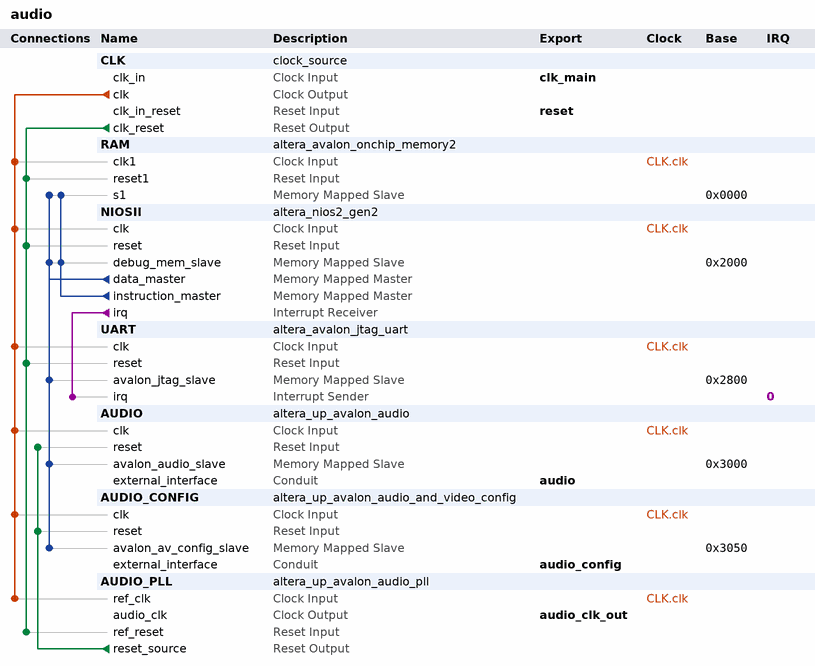
[diagram p0: system contents]
# Platform Designer (Qsys) system audio, Cyclone V 5CSEMA5F31C6
# Parameters at their usual value, and those the tool derives, are not listed.
package require -exact qsys 18.1
create_system audio
set_project_property DEVICE_FAMILY {Cyclone V}
set_project_property DEVICE 5CSEMA5F31C6

add_instance CLK clock_source 18.1
set_instance_parameter_value CLK clockFrequency 50000000
set_instance_parameter_value CLK clockFrequencyKnown false

add_instance RAM altera_avalon_onchip_memory2 18.1
set_instance_parameter_value RAM dataWidth 32
set_instance_parameter_value RAM dualPort false
set_instance_parameter_value RAM initMemContent true
set_instance_parameter_value RAM initializationFileName onchip_mem.hex
set_instance_parameter_value RAM memorySize 8192

add_instance NIOSII altera_nios2_gen2 18.1
set_instance_parameter_value NIOSII dcache_size 2048
set_instance_parameter_value NIOSII exceptionSlave RAM.s1
set_instance_parameter_value NIOSII icache_size 4096
set_instance_parameter_value NIOSII impl Tiny
set_instance_parameter_value NIOSII resetSlave RAM.s1

add_instance UART altera_avalon_jtag_uart 18.1
set_instance_parameter_value UART simInteractiveOptions NO_INTERACTIVE_WINDOWS

add_instance AUDIO altera_up_avalon_audio 18.0
set_instance_parameter_value AUDIO audio_in false
set_instance_parameter_value AUDIO avalon_bus_type {Memory Mapped}
set_instance_parameter_value AUDIO dw 16

add_instance AUDIO_CONFIG altera_up_avalon_audio_and_video_config 18.0
set_instance_parameter_value AUDIO_CONFIG audio_in {Microphone to ADC}
set_instance_parameter_value AUDIO_CONFIG bit_length 16
set_instance_parameter_value AUDIO_CONFIG board DE1-SoC
set_instance_parameter_value AUDIO_CONFIG line_in_bypass false
set_instance_parameter_value AUDIO_CONFIG sampling_rate {48 kHz}

add_instance AUDIO_PLL altera_up_avalon_audio_pll 18.0
set_instance_parameter_value AUDIO_PLL gui_refclk 50.0

# connections
add_connection CLK.clk AUDIO.clk clock
add_connection CLK.clk AUDIO_CONFIG.clk clock
add_connection CLK.clk AUDIO_PLL.ref_clk clock
add_connection CLK.clk NIOSII.clk clock
add_connection CLK.clk RAM.clk1 clock
add_connection CLK.clk UART.clk clock
add_connection AUDIO_PLL.reset_source AUDIO.reset reset
add_connection AUDIO_PLL.reset_source AUDIO_CONFIG.reset reset
add_connection CLK.clk_reset AUDIO_PLL.ref_reset reset
add_connection CLK.clk_reset NIOSII.reset reset
add_connection CLK.clk_reset RAM.reset1 reset
add_connection CLK.clk_reset UART.reset reset
add_connection NIOSII.data_master AUDIO.avalon_audio_slave avalon
set_connection_parameter_value NIOSII.data_master/AUDIO.avalon_audio_slave baseAddress 0x3000
add_connection NIOSII.data_master AUDIO_CONFIG.avalon_av_config_slave avalon
set_connection_parameter_value NIOSII.data_master/AUDIO_CONFIG.avalon_av_config_slave baseAddress 0x3050
add_connection NIOSII.data_master NIOSII.debug_mem_slave avalon
set_connection_parameter_value NIOSII.data_master/NIOSII.debug_mem_slave baseAddress 0x2000
add_connection NIOSII.data_master RAM.s1 avalon
set_connection_parameter_value NIOSII.data_master/RAM.s1 baseAddress 0x0000
add_connection NIOSII.data_master UART.avalon_jtag_slave avalon
set_connection_parameter_value NIOSII.data_master/UART.avalon_jtag_slave baseAddress 0x2800
add_connection NIOSII.instruction_master NIOSII.debug_mem_slave avalon
set_connection_parameter_value NIOSII.instruction_master/NIOSII.debug_mem_slave baseAddress 0x2000
add_connection NIOSII.instruction_master RAM.s1 avalon
set_connection_parameter_value NIOSII.instruction_master/RAM.s1 baseAddress 0x0000
add_connection NIOSII.irq UART.irq interrupt
set_connection_parameter_value NIOSII.irq/UART.irq irqNumber 0

# exported interfaces
add_interface audio conduit end
set_interface_property audio EXPORT_OF AUDIO.external_interface
add_interface audio_clk_out clock source
set_interface_property audio_clk_out EXPORT_OF AUDIO_PLL.audio_clk
add_interface audio_config conduit end
set_interface_property audio_config EXPORT_OF AUDIO_CONFIG.external_interface
add_interface clk_main clock sink
set_interface_property clk_main EXPORT_OF CLK.clk_in
add_interface reset reset sink
set_interface_property reset EXPORT_OF CLK.clk_in_reset

set_interconnect_requirement {$system} qsys_mm.clockCrossingAdapter HANDSHAKE
set_interconnect_requirement {$system} qsys_mm.enableEccProtection FALSE
set_interconnect_requirement {$system} qsys_mm.insertDefaultSlave FALSE
set_interconnect_requirement {$system} qsys_mm.maxAdditionalLatency 1

save_system audio.qsys
